# Altium project ddrlegobrick.PrjPcb (part 2 of 2)
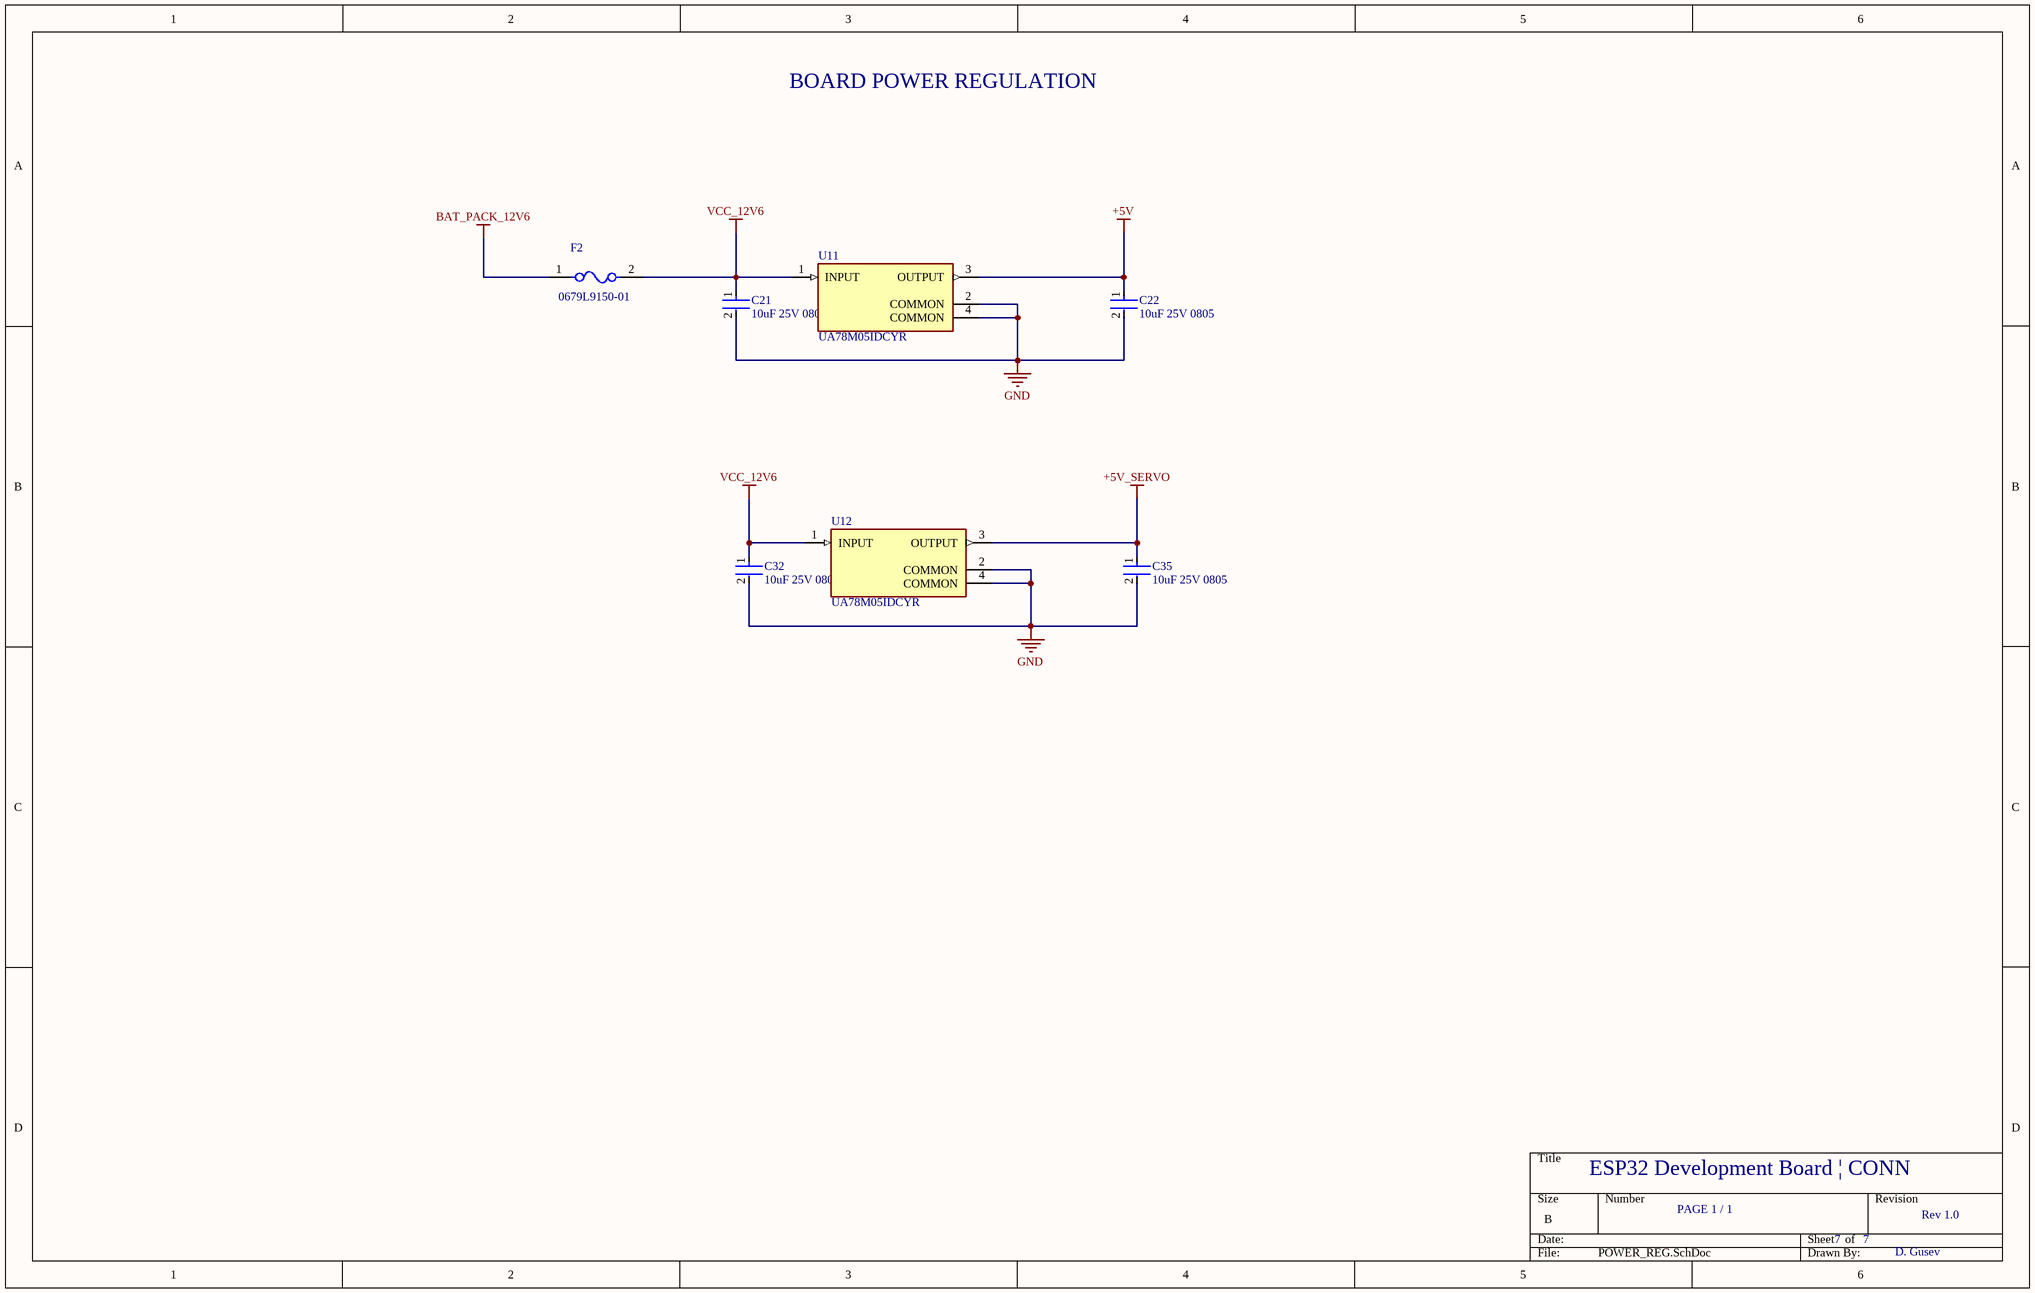
[diagram p7: POWER_REG.SchDoc]

## Nets that join several sheets
+3V3: USB-ESP32 (11 pins), ESP32 (5 pins)
+5_USB_IN: USB-ESP32 (7 pins), CHARGING (6 pins)
+5V: USB-ESP32 (C25.1 R4.1 R8.2 U13.1), ESP32 (SYS_LED.4), GPIO_EXT (11 pins), POWER_REG (C22.1 U11.3)
+5V_SERVO: CONN (SERVO.2), POWER_REG (C35.1 U12.3)
BAT_PACK_12V6: CHARGING (BAT3.1 U7.5), POWER_REG (F2.1)
GND: USB-ESP32 (24 pins), ESP32 (10 pins), GPIO_EXT (6 pins), DRV8833 (24 pins), CONN (5 pins), CHARGING (18 pins), POWER_REG (8 pins)
VCC_12V6: DRV8833 (12 pins), CONN (MOTOR1.VCC MOTOR2.VCC MOTOR3.VCC MOTOR4.VCC), CHARGING (R34.2), POWER_REG (5 pins)
BAT1_CHRG*: GPIO_EXT (RA2.3 U14.21), CHARGING (U9.7)
BAT1_STDBY*: GPIO_EXT (RA2.4 U14.22), CHARGING (U9.6)
BAT2_CHRG*: GPIO_EXT (RA2.1 U14.19), CHARGING (U8.7)
BAT2_STDBY*: GPIO_EXT (RA2.2 U14.20), CHARGING (U8.6)
BAT3_CHRG*: GPIO_EXT (RA1.3 U14.18), CHARGING (U7.7)
BAT3_STDBY*: GPIO_EXT (RA1.4 U14.17), CHARGING (U7.6)
BAT_CHRG_LVL: ESP32 (ESP32.7), CHARGING (R34.1 R35.2)
BAT_PACK_CONN_8V4: GPIO_EXT (U14.1), CHARGING (R40.1 R41.1)
BAT_PACK_CONN_12V6: GPIO_EXT (U14.2), CHARGING (R37.1 R38.1)
CHRG_EN_GND: GPIO_EXT (U14.25), CHARGING (R43.2 R44.2)
CHRG_START_4V2: GPIO_EXT (U14.28), CHARGING (U9.8)
CHRG_START_8V4: GPIO_EXT (U14.27), CHARGING (U8.8)
CHRG_START_12V6: GPIO_EXT (U14.26), CHARGING (U7.8)
ESP32-I2C-SCL: ESP32 (ESP32.36), GPIO_EXT (RA1.1 U14.8)
ESP32-I2C-SDA: ESP32 (ESP32.33), GPIO_EXT (RA1.2 U14.9)
ESP32_RX: USB-ESP32 (U1.21), ESP32 (ESP32.34)
ESP32_TX: USB-ESP32 (U1.20), ESP32 (ESP32.35)
GPIO0: USB-ESP32 (Q2.3), ESP32 (ESP32.25 ESP32_BOOT.2 R13.1)
MOTOR1_CHA: DRV8833 (U3.2 U3.7), CONN (MOTOR1.C1)
MOTOR1_CHB: DRV8833 (U3.4 U3.5), CONN (MOTOR1.C2)
MOTOR1_PWM_A: ESP32 (ESP32.8), DRV8833 (U3.9 U3.16)
MOTOR1_PWM_B: ESP32 (ESP32.9), DRV8833 (U3.10 U3.15)
MOTOR2_CHA: DRV8833 (U4.2 U4.7), CONN (MOTOR2.C1)
MOTOR2_CHB: DRV8833 (U4.4 U4.5), CONN (MOTOR2.C2)
MOTOR2_PWM_A: ESP32 (ESP32.10), DRV8833 (U4.9 U4.16)
MOTOR2_PWM_B: ESP32 (ESP32.11), DRV8833 (U4.10 U4.15)
MOTOR3_CHA: DRV8833 (U5.2 U5.7), CONN (MOTOR3.C1)
MOTOR3_CHB: DRV8833 (U5.4 U5.5), CONN (MOTOR3.C2)
MOTOR3_PWM_A: ESP32 (ESP32.30), DRV8833 (U5.9 U5.16)
MOTOR3_PWM_B: ESP32 (ESP32.31), DRV8833 (U5.10 U5.15)
MOTOR4_CHA: DRV8833 (U6.2 U6.7), CONN (MOTOR4.C1)
MOTOR4_CHB: DRV8833 (U6.4 U6.5), CONN (MOTOR4.C2)
MOTOR4_PWM_A: ESP32 (ESP32.27), DRV8833 (U6.9 U6.16)
MOTOR4_PWM_B: ESP32 (ESP32.28), DRV8833 (U6.10 U6.15)
MOTOR_DRV1_EN: GPIO_EXT (U14.4), DRV8833 (R14.1)
MOTOR_DRV2_EN: GPIO_EXT (U14.23), DRV8833 (R15.1)
MOTOR_DRV3_EN: GPIO_EXT (U14.3), DRV8833 (R16.1)
MOTOR_DRV4_EN: GPIO_EXT (U14.24), DRV8833 (R17.1)
RESET: USB-ESP32 (Q1.3), ESP32 (ESP32.3 ESP32_RESET.2 R12.1)
SERVO_PWM: ESP32 (ESP32.37), CONN (SERVO.3)
USB_PWR_DET: USB-ESP32 (R31.1), ESP32 (R47.2)